# Altium project Switch.PrjPCB
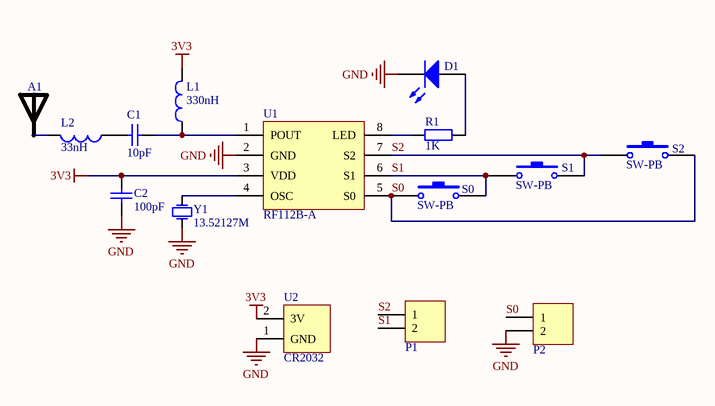
[diagram p0: Switch.SchDoc]
1 sheet, 15 parts. Net scope: global (net labels, ports and power ports of the same name join across sheets).
Board files: Switch.PcbDoc, Switch_230802.PcbDoc, Switch_SpliceBoard.PcbDoc

## Sheet Switch.SchDoc
size A4

### Parts
A1  ANT  [ANT15030R433]  (value not drawn)
C1  value 10pF  [0603-2]  (hidden comment: Cap)
C2  value 100pF  [0603-2]  (hidden comment: Cap)
D1  LED0  [LED_0603]  (value not drawn)
L1  value 330nH  [0603-1]  (hidden comment: Inductor)
L2  value 33nH  [0603-1]  (hidden comment: Inductor)
P1  Header 2  [HDR2X1_焊接版]  (value not drawn)
P2  Header 2  [HDR2X1_焊接版]  (value not drawn)
R1  value 1K  [0603-1]  (hidden comment: 12K)
S0  SW-PB  [SW_PB2_A1]
S1  SW-PB  [SW_PB2_A1]
S2  SW-PB  [SW_PB2_A1]
U1  RF112B-A  [SOIC-8]
U2  CR2032  [CR2032-SMD]
Y1  value 13.52127M  [X-SM49]  (hidden comment: XTAL)

### Nets
3V3: C2.2 L1.2 U1.3(VDD) U2.2(3V)
GND: C2.1 D1.2(K) P2.2 U1.2(GND) U2.1(GND) Y1.1
S0: P2.1 S0.1 S2.2 U1.5(S0)
S1: P1.2 S0.2 S1.1 U1.6(S1)
S2: P1.1 S1.2 S2.1 U1.7(S2)
NetA1_1: A1.1 L2.2
NetC1_1: C1.1 L2.1
NetC1_2: C1.2 L1.1 U1.1(POUT)
NetD1_1: D1.1(A) R1.1
NetR1_2: R1.2 U1.8(LED)
NetU1_4: U1.4(OSC) Y1.2

### Library data of the parts
C1 C2 = Cap: 无极性电容; Published: 8-Jun-2000; LatestRevisionDate: 17-Jul-2002; LatestRevisionNote: Re-released for DXP Platform.; PackageReference: RAD-0.3; Publisher: Altium Limited
D1 = LED0: 发光二极管; Published: 8-Jun-2000; LatestRevisionDate: 08-Jul-2005; LatestRevisionNote: Mech Layer 1 removed.; PackageReference: LED-0; Publisher: Altium Limited
L1 L2 = Inductor: 电感; Code_IEC: 1005; Published: 8-Jun-2000; LatestRevisionDate: 17-Jul-2002; LatestRevisionNote: Re-released for DXP Platform.; PackageReference: 0402-A; Publisher: Altium Limited; Code_JEITA: 0402
P1 P2 = Header 2: 接插件; LatestRevisionDate: 17-Jul-2002; LatestRevisionNote: Re-released for DXP Platform.; Publisher: Altium Limited
R1 = Res1: 贴片电阻; Published: 8-Jun-2000; LatestRevisionDate: 17-Jul-2002; LatestRevisionNote: Re-released for DXP Platform.; PackageReference: AXIAL-0.4; Publisher: Altium Limited
S0-S2 = SW-PB: 微动开关; Published: 24-Mar-1999; LatestRevisionDate: 17-Jul-2002; LatestRevisionNote: Re-released for DXP Platform.; PackageReference: SPST-2; Publisher: Altium Limited
U1 = RF112B-A: 内置编码无线发射芯片
U2 = CR2032: 纽扣电池座
Y1 = XTAL: 晶振; Published: 8-Jun-2000; LatestRevisionDate: 17-Jul-2002; LatestRevisionNote: Re-released for DXP Platform.; PackageReference: R38; Publisher: Altium Limited